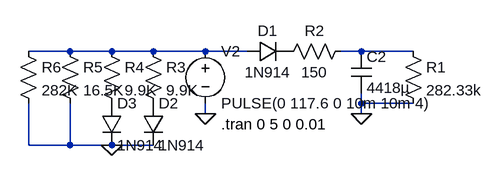
[diagram p0: schematic Precharge.asc]
Precharge.asc, the LTspice schematic file:
Version 4
SHEET 1 880 680
WIRE 128 144 64 144
WIRE 192 144 128 144
WIRE 256 144 192 144
WIRE 336 144 256 144
WIRE 400 144 336 144
WIRE 576 144 544 144
WIRE 656 144 576 144
WIRE 576 224 576 208
WIRE 656 224 576 224
WIRE 336 240 336 224
WIRE 576 240 576 224
WIRE 64 288 64 224
WIRE 128 288 128 224
WIRE 128 288 64 288
WIRE 192 288 128 288
WIRE 256 288 192 288
FLAG 336 240 0
FLAG 576 240 0
FLAG 192 288 0
SYMBOL voltage 336 128 R0
WINDOW 123 0 0 Left 0
WINDOW 39 0 0 Left 0
SYMATTR InstName V2
SYMATTR Value PULSE(0 117.6 0 10m 10m 4)
SYMBOL res 560 128 R90
WINDOW 0 0 56 VBottom 2
WINDOW 3 32 56 VTop 2
SYMATTR InstName R2
SYMATTR Value 150
SYMBOL cap 560 144 R0
SYMATTR InstName C2
SYMATTR Value 4418µ
SYMBOL diode 400 160 R270
WINDOW 0 32 32 VTop 2
WINDOW 3 0 32 VBottom 2
SYMATTR InstName D1
SYMATTR Value 1N914
SYMBOL res 640 128 R0
SYMATTR InstName R1
SYMATTR Value 282.33k
SYMBOL res 240 128 R0
SYMATTR InstName R3
SYMATTR Value 9.9K
SYMBOL res 176 128 R0
SYMATTR InstName R4
SYMATTR Value 9.9K
SYMBOL res 112 128 R0
SYMATTR InstName R5
SYMATTR Value 16.5K
SYMBOL diode 240 224 R0
SYMATTR InstName D2
SYMATTR Value 1N914
SYMBOL diode 176 224 R0
SYMATTR InstName D3
SYMATTR Value 1N914
SYMBOL res 48 128 R0
SYMATTR InstName R6
SYMATTR Value 282K
TEXT 360 256 Left 2 !.tran 0 5 0 0.01

The netlist it stands for:
* Precharge.asc
V2 N001 0 PULSE(0 117.6 0 10m 10m 4)
R2 N002 P001 150
C2 N002 0 4418µ
D1 N001 P001 1N914
R1 N002 0 282.33k
R3 N001 P002 9.9K
R4 N001 P003 9.9K
R5 N001 0 16.5K
D2 P002 0 1N914
D3 P003 0 1N914
R6 N001 0 282K
.model D D
.lib standard.dio
.tran 0 5 0 0.01
.backanno
.end